# EAGLE schematic figure-4-base (EAGLE 7.6.0)

## Sheet 1 of 2
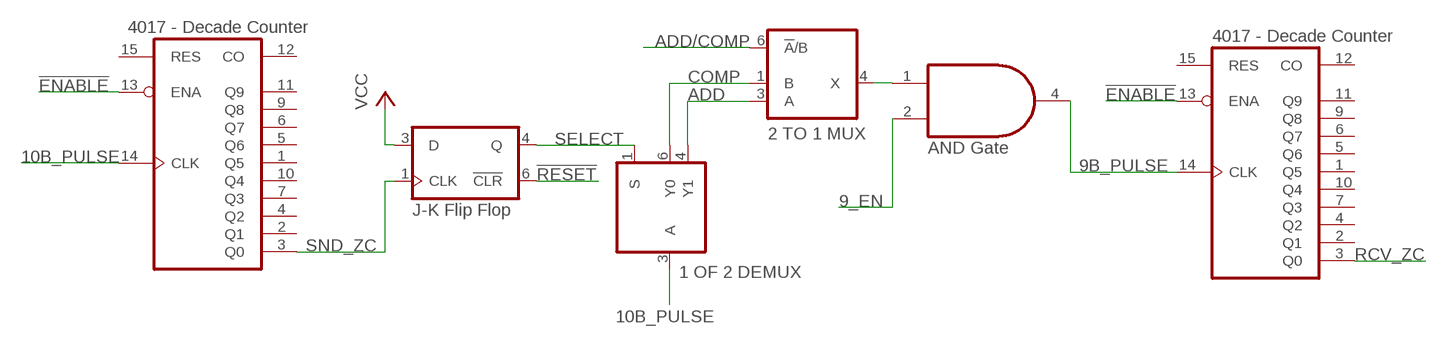
[diagram p0: schematic, sheet 1]

### Parts
IC2  1 OF 2 DEMUX  741G18  [DBV_R-PDSO-G6]
IC5  J-K Flip Flop  741G175  [DBV_R-PDSO-G6]
IC7  2 TO 1 MUX  741G3157DBVR  [DBV_R-PDSO-G6]
IC8  4017 - Decade Counter  4017D  [SO16]
IC12  4017 - Decade Counter  4017D  [SO16]
IC13  AND Gate  74LVC1G08DBV  [SOT23-5]

### Nets
9_EN: IC13.2(I1)
9B_PULSE: IC12.14(CLK) IC13.4(O)
10B_PULSE: IC2.3(A) IC8.14(CLK) ; also sheet 2
!ENABLE: IC8.13(ENA) IC12.13(ENA)
!RESET: IC5.6(!CLR) ; also sheet 2
ADD: IC2.4(Y1) IC7.3(A) ; also sheet 2
ADD/COMP: IC7.6(!A!/B) ; also sheet 2
COMP: IC2.6(Y0) IC7.1(B) ; also sheet 2
N$1: IC7.4(X) IC13.1(I0)
RCV_ZC: IC12.3(Q0) ; also sheet 2
SELECT: IC2.1(S) IC5.4(Q) ; also sheet 2
SND_ZC: IC5.1(CLK) IC8.3(Q0) ; also sheet 2
VCC: IC5.3(D) ; also sheet 2
Unconnected: IC8.1(Q5) IC8.2(Q1) IC8.4(Q2) IC8.5(Q6) IC8.6(Q7) IC8.7(Q3) IC8.9(Q8) IC8.10(Q4) IC8.11(Q9) IC8.12(CO) IC8.15(RES) IC12.1(Q5) IC12.2(Q1) IC12.4(Q2) IC12.5(Q6) IC12.6(Q7) IC12.7(Q3) IC12.9(Q8) IC12.10(Q4) IC12.11(Q9) IC12.12(CO) IC12.15(RES)

## Sheet 2 of 2
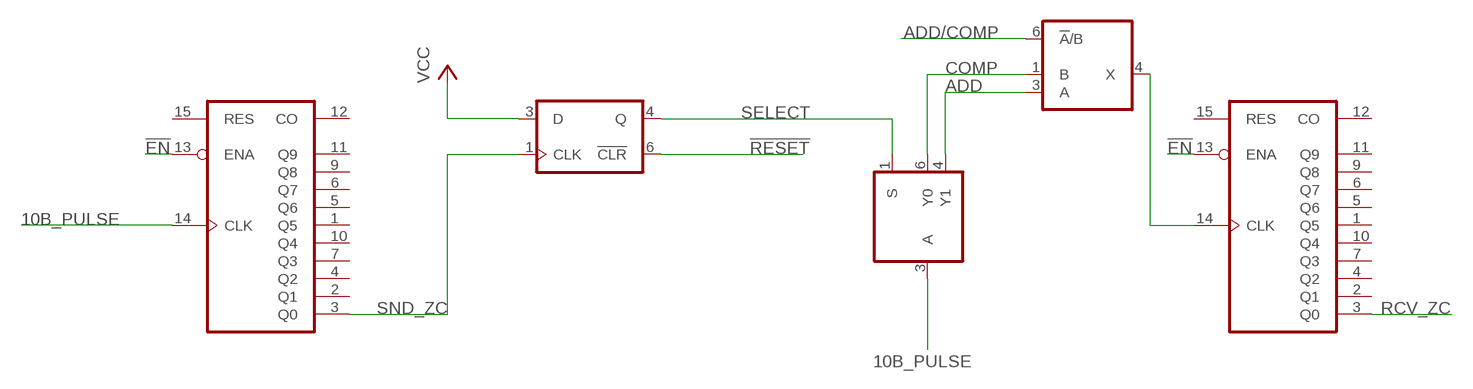
[diagram p1: schematic, sheet 2]

### Parts
IC1  J-K Flip Flop  741G175  [DBV_R-PDSO-G6]
IC3  4017 - Decade Counter  4017D  [SO16]
IC4  1 OF 2 DEMUX  741G18  [DBV_R-PDSO-G6]
IC6  2 TO 1 MUX  741G3157DBVR  [DBV_R-PDSO-G6]
IC9  4017 - Decade Counter  4017D  [SO16]

### Nets
10B_PULSE: IC3.14(CLK) IC4.3(A) ; also sheet 1
!EN: IC3.13(ENA) IC9.13(ENA)
!RESET: IC1.6(!CLR) ; also sheet 1
ADD: IC4.4(Y1) IC6.3(A) ; also sheet 1
ADD/COMP: IC6.6(!A!/B) ; also sheet 1
COMP: IC4.6(Y0) IC6.1(B) ; also sheet 1
RCV_PULSE: IC6.4(X) IC9.14(CLK)
RCV_ZC: IC9.3(Q0) ; also sheet 1
SELECT: IC1.4(Q) IC4.1(S) ; also sheet 1
SND_ZC: IC1.1(CLK) IC3.3(Q0) ; also sheet 1
VCC: IC1.3(D) ; also sheet 1
Unconnected: IC3.1(Q5) IC3.2(Q1) IC3.4(Q2) IC3.5(Q6) IC3.6(Q7) IC3.7(Q3) IC3.9(Q8) IC3.10(Q4) IC3.11(Q9) IC3.12(CO) IC3.15(RES) IC9.1(Q5) IC9.2(Q1) IC9.4(Q2) IC9.5(Q6) IC9.6(Q7) IC9.7(Q3) IC9.9(Q8) IC9.10(Q4) IC9.11(Q9) IC9.12(CO) IC9.15(RES)

## Power pins joined to a net without a drawn wire
GND: IC1.2(GND) IC2.2(GND) IC4.2(GND) IC5.2(GND) IC6.2(GND) IC7.2(GND) IC13.3(GND)
VCC: IC1.5(VCC) IC2.5(VCC) IC4.5(VCC) IC5.5(VCC) IC6.5(VCC) IC7.5(VCC) IC13.5(VCC)
VDD: IC3.16(VDD) IC8.16(VDD) IC9.16(VDD) IC12.16(VDD)
VSS: IC3.8(VSS) IC8.8(VSS) IC9.8(VSS) IC12.8(VSS)

## Library data of the parts
IC1 IC5 = witch-e:74*1G175
IC2 IC4 = witch-e:74*1G18: 1-OF-2 NONINVERTING DEMULTIPLEXER WITH 3-STATE DESELECTED OUTPUT
IC3 IC8 IC9 IC12 = 40xx:4017: COUNTER/DIVIDER
IC6 IC7 = 74xx-little-us:74*1G3157: Single-Pole, Double-Throw Analog Switch Source: http://focus.ti.com/lit/ds/symlink/sn74lvc1g3157.pdf
IC13 = 74xx-little-us:74*1G08: 2-input AND gate